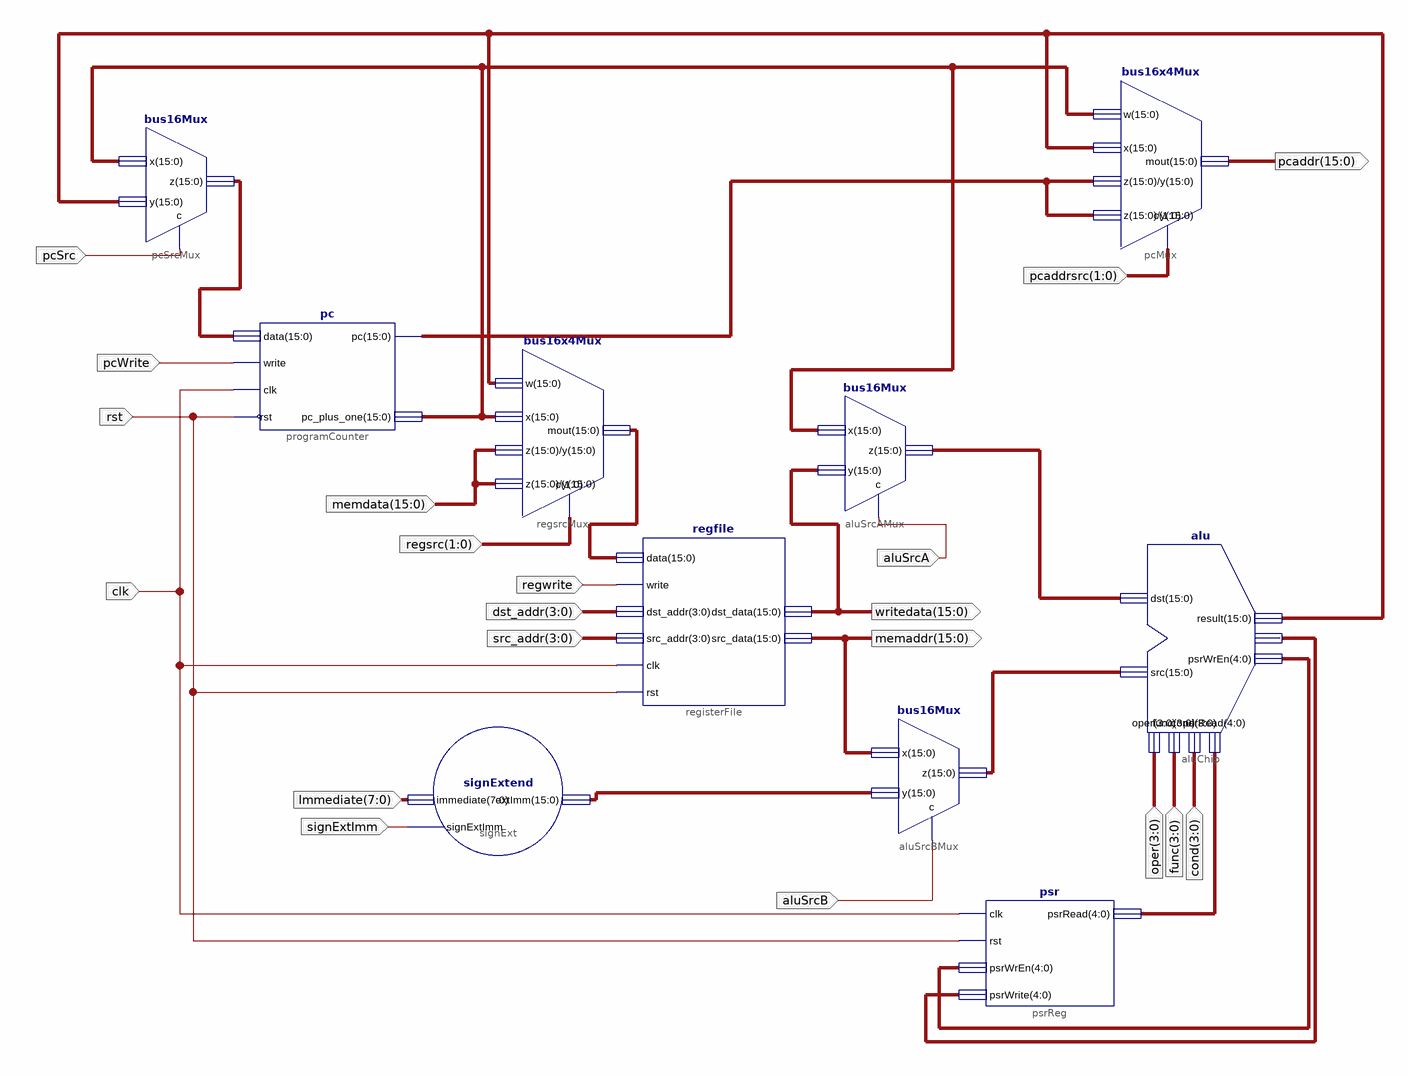
[diagram p0: schematic sheet 1]
// Xilinx ISE schematic alu_schematic.sch (xa9500xl) as structural Verilog: 10 symbols, 20 ports
module alu_schematic (
  input  pcSrc,
  input  [3:0] src_addr,
  input  [3:0] dst_addr,
  input  regwrite,
  input  [3:0] oper,
  input  [3:0] func,
  input  [3:0] cond,
  input  clk,
  input  rst,
  input  pcWrite,
  input  [15:0] memdata,
  input  aluSrcB,
  input  aluSrcA,
  input  [1:0] regsrc,
  input  [1:0] pcaddrsrc,
  input  signExtImm,
  input  [7:0] Immediate,
  output [15:0] writedata,
  output [15:0] pcaddr,
  output [15:0] memaddr
);

  wire [4:0] XLXN_132, XLXN_135, XLXN_136;
  wire [15:0] result, XLXN_6, XLXN_7, XLXN_20, XLXN_115, XLXN_125, XLXN_126, XLXN_129;

  regfile registerFile (
    .data(XLXN_20), .write(regwrite), .dst_addr(dst_addr), .dst_data(writedata), .src_addr(src_addr),
    .src_data(memaddr), .clk(clk), .rst(rst));
  bus16Mux pcSrcMux (.c(pcSrc), .x(XLXN_115), .y(result), .z(XLXN_125));
  pc programCounter (.pc_plus_one(XLXN_115), .write(pcWrite), .clk(clk), .rst(rst), .data(XLXN_125), .pc(XLXN_129));
  bus16x4Mux regsrcMux (.c(regsrc), .mout(XLXN_20), .z(memdata), .x(XLXN_115), .y(memdata), .w(result));
  bus16Mux aluSrcBMux (.c(aluSrcB), .x(memaddr), .y(XLXN_126), .z(XLXN_7));
  bus16Mux aluSrcAMux (.c(aluSrcA), .x(XLXN_115), .y(writedata), .z(XLXN_6));
  bus16x4Mux pcMux (.c(pcaddrsrc), .mout(pcaddr), .z(XLXN_129), .x(result), .y(XLXN_129), .w(XLXN_115));
  signExtend signExt (.extImm(XLXN_126), .immediate(Immediate), .signExtImm(signExtImm));
  alu aluChip (
    .dst(XLXN_6), .oper(oper), .func(func), .src(XLXN_7), .cond(cond), .psrRead(XLXN_132), .result(result),
    .psrWrite(XLXN_135), .psrWrEn(XLXN_136));
  psr psrReg (.clk(clk), .psrRead(XLXN_132), .psrWrEn(XLXN_136), .psrWrite(XLXN_135), .rst(rst));
endmodule
